# Altium schematic sheet MicsBus.SchDoc: Main
size A4; Organization: Autobot Limited; Address1: 96, boulevard Bessiere; Address4: 75017 PARIS; SheetNumber: 1
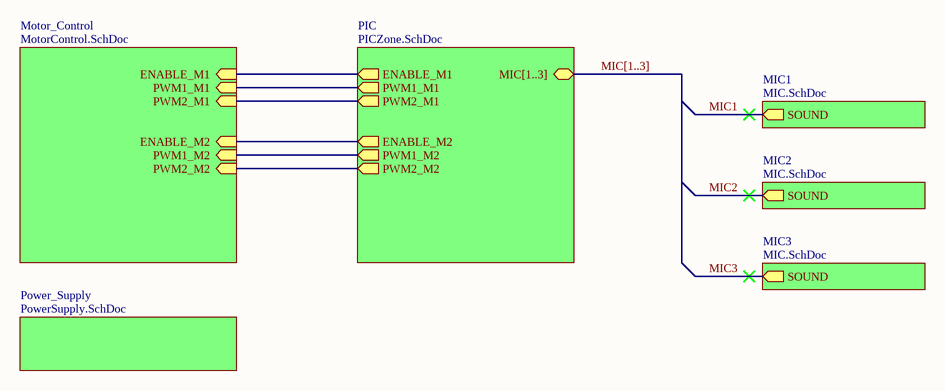
[diagram p0: MicsBus.SchDoc]

## Sub-sheets
MIC1 = MIC.SchDoc: SOUND (out)
MIC2 = MIC.SchDoc: SOUND (out)
MIC3 = MIC.SchDoc: SOUND (out)
Motor_Control = MotorControl.SchDoc: PWM1_M1 (in), PWM2_M1 (in), ENABLE_M1 (in), PWM1_M2 (in), PWM2_M2 (in), ENABLE_M2 (in)
PIC = PICZone.SchDoc: MIC[1..3], PWM1_M1 (out), PWM2_M1 (out), ENABLE_M1 (out), ENABLE_M2 (out), PWM1_M2 (out), PWM2_M2 (out)
Power_Supply = PowerSupply.SchDoc: no entries

## Nets
MIC1: sheet MIC1/SOUND
MIC2: sheet MIC2/SOUND
MIC3: sheet MIC3/SOUND
(unnamed): sheet PIC/PWM1_M1, sheet Motor_Control/PWM1_M1
(unnamed): sheet PIC/PWM2_M1, sheet Motor_Control/PWM2_M1
(unnamed): sheet PIC/ENABLE_M1, sheet Motor_Control/ENABLE_M1
(unnamed): sheet PIC/ENABLE_M2, sheet Motor_Control/ENABLE_M2
(unnamed): sheet PIC/PWM1_M2, sheet Motor_Control/PWM1_M2
(unnamed): sheet PIC/PWM2_M2, sheet Motor_Control/PWM2_M2

## Buses and harness runs
bus MIC[1..3] = sheet PIC/MIC[1..3]

## Notes on the sheet
- Title
- Size:
- Date:
- A4
- Number:
- Time:
- Revision:
- Sheet
- of
- File: